# EAGLE board cas48 (EAGLE 5.10), part 1 of 2
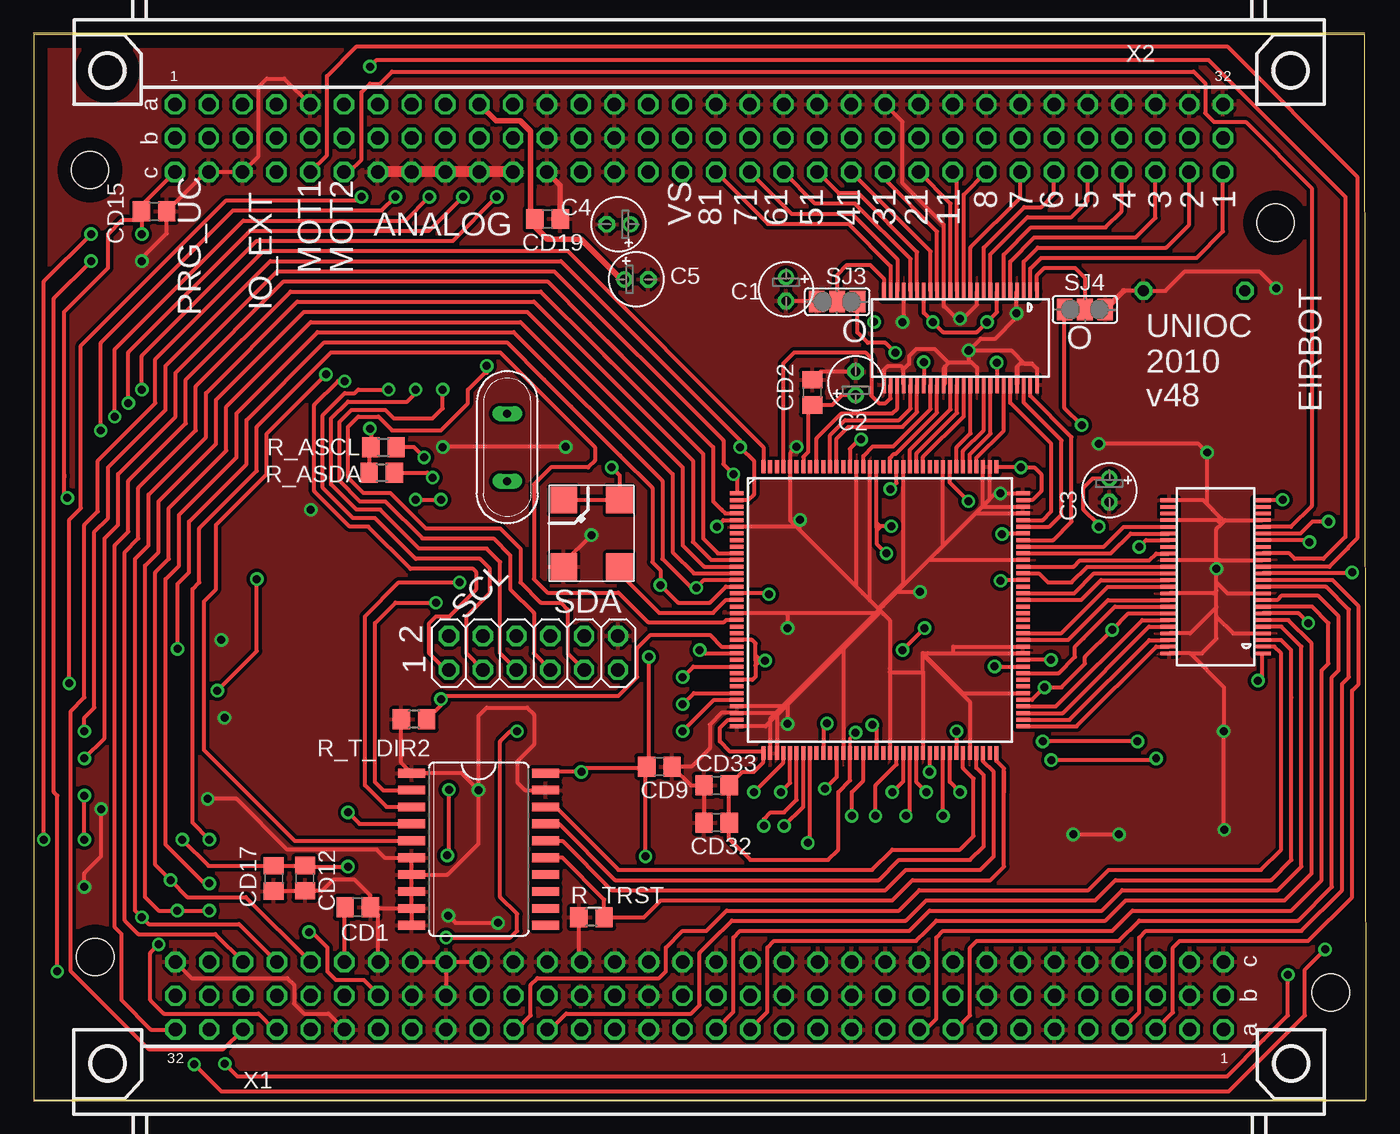
[diagram p2: board, top side]
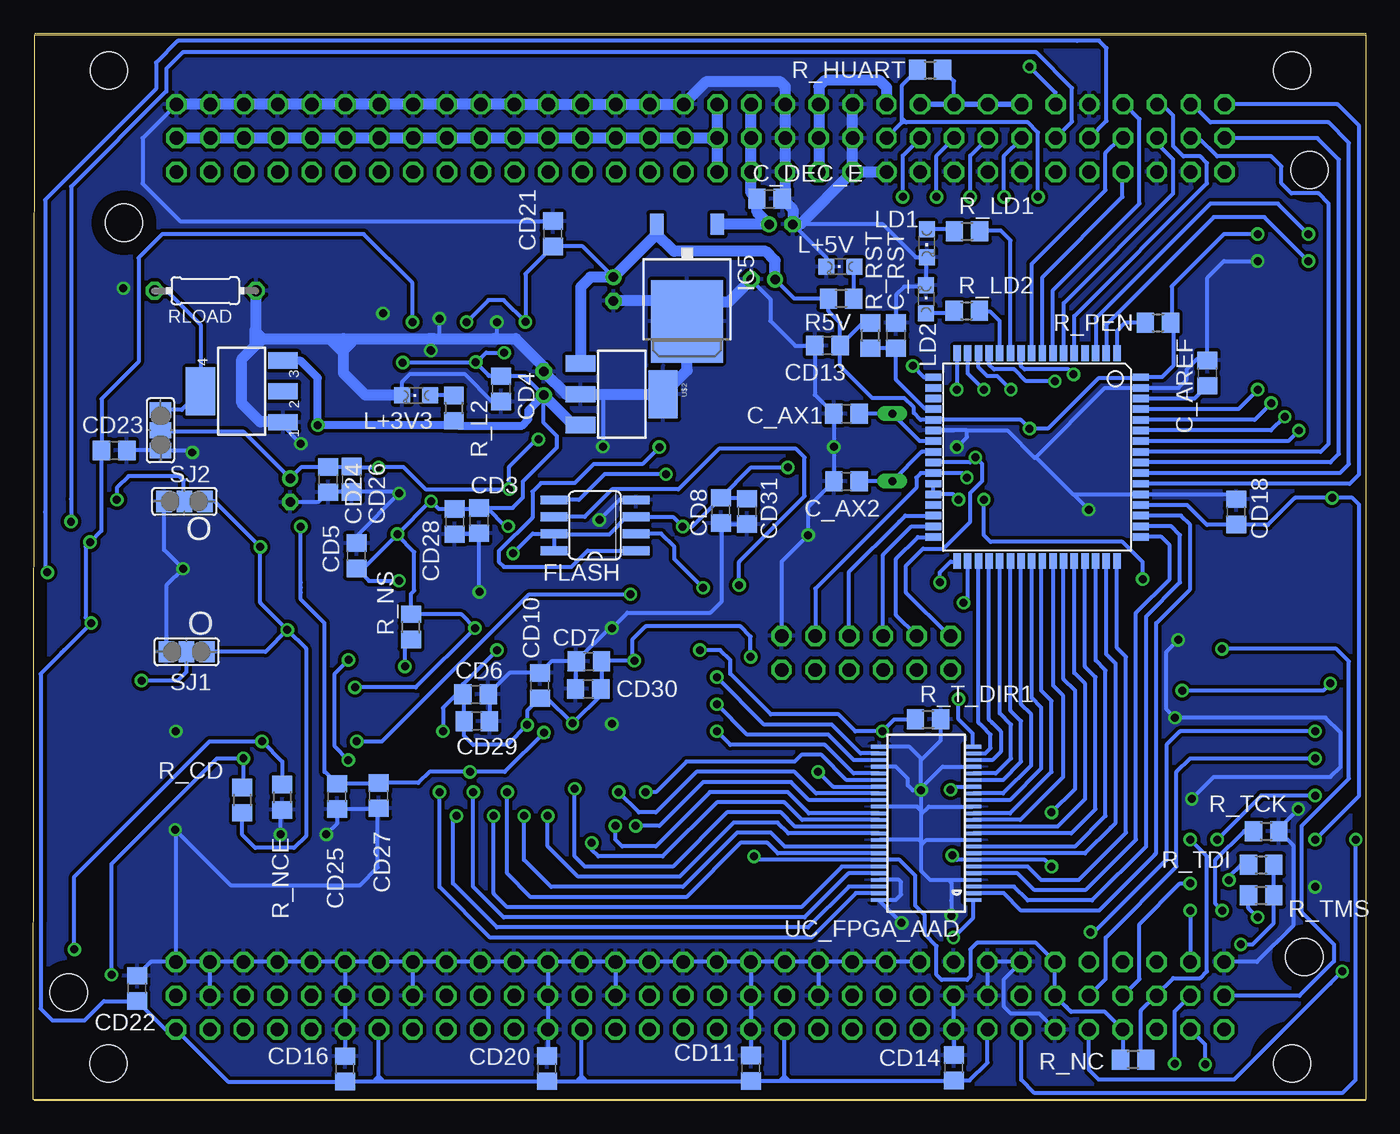
[diagram p3: board, bottom side, seen from below]

Size 100.11 x 80 mm. Coordinates in mm from the lower left corner, seen from the top.
Outline: 0,0 100.11,0 100,80 0,80 0,0
Copper layers (1*16): Top 0.035mm / dielectric 1.5mm / Bottom 0.035mm
Design rules "default *": minimum track width 10mil, minimum drill 24mil, track to track 10mil, track to pad 10mil, pad to pad 10mil, via to via 10mil, smd to smd 10mil, copper to edge 40mil, drill to drill 8mil, minimum pad ring 10mil, minimum via ring 8mil, stop-mask expansion 4mil, vias tented up to drill 0mil, thermal gap 10mil
Holes 2.8 mm at 4.24,69.84 93.3,65.88 97.45,8.06 4.63,10.74

## Footprints (pad centres in the part's own frame; a part is rotated, then mirrored left to right if it is on the bottom)
E1,8-4 = drill 0.711 pad 1.168 round: + -0.889,0 | drill 0.711 pad 1.168 octagon: - 0.889,0
C0805 = smd 1.3 x 1.5: 1 -0.95,0; 2 0.95,0
SO08 = smd 0.66 x 2.032: 1 -1.905,-3.073; 2 -0.635,-3.073; 3 0.635,-3.073; 4 1.905,-3.073; 5 1.905,3.073; 6 0.635,3.073; 7 -0.635,3.073; 8 -1.905,3.073
TQFP144 = smd 1 x 0.3: 1 -10.75,8.75; 2 -10.75,8.25; 3 -10.75,7.75; 4 -10.75,7.25; 5 -10.75,6.75; 6 -10.75,6.25; 7 -10.75,5.75; 8 -10.75,5.25; 9 -10.75,4.75; 10 -10.75,4.25; 11 -10.75,3.75; 12 -10.75,3.25; 13 -10.75,2.75; 14 -10.75,2.25; 15 -10.75,1.75; 16 -10.75,1.25; 17 -10.75,0.75; 18 -10.75,0.25; 19 -10.75,-0.25; 20 -10.75,-0.75; 21 -10.75,-1.25; 22 -10.75,-1.75; 23 -10.75,-2.25; 24 -10.75,-2.75; 25 -10.75,-3.25; 26 -10.75,-3.75; 27 -10.75,-4.25; 28 -10.75,-4.75; 29 -10.75,-5.25; 30 -10.75,-5.75; 31 -10.75,-6.25; 32 -10.75,-6.75; 33 -10.75,-7.25; 34 -10.75,-7.75; 35 -10.75,-8.25; 36 -10.75,-8.75; 73 10.75,-8.75; 74 10.75,-8.25; 75 10.75,-7.75; 76 10.75,-7.25; 77 10.75,-6.75; 78 10.75,-6.25; 79 10.75,-5.75; 80 10.75,-5.25; 81 10.75,-4.75; 82 10.75,-4.25; 83 10.75,-3.75; 84 10.75,-3.25; 85 10.75,-2.75; 86 10.75,-2.25; 87 10.75,-1.75; 88 10.75,-1.25; 89 10.75,-0.75; 90 10.75,-0.25; 91 10.75,0.25; 92 10.75,0.75; 93 10.75,1.25; 94 10.75,1.75; 95 10.75,2.25; 96 10.75,2.75; 97 10.75,3.25; 98 10.75,3.75; 99 10.75,4.25; 100 10.75,4.75; 101 10.75,5.25; 102 10.75,5.75; 103 10.75,6.25; 104 10.75,6.75; 105 10.75,7.25; 106 10.75,7.75; 107 10.75,8.25; 108 10.75,8.75 | smd 0.3 x 1: 37 -8.75,-10.75; 38 -8.25,-10.75; 39 -7.75,-10.75; 40 -7.25,-10.75; 41 -6.75,-10.75; 42 -6.25,-10.75; 43 -5.75,-10.75; 44 -5.25,-10.75; 45 -4.75,-10.75; 46 -4.25,-10.75; 47 -3.75,-10.75; 48 -3.25,-10.75; 49 -2.75,-10.75; 50 -2.25,-10.75; 51 -1.75,-10.75; 52 -1.25,-10.75; 53 -0.75,-10.75; 54 -0.25,-10.75; 55 0.25,-10.75; 56 0.75,-10.75; 57 1.25,-10.75; 58 1.75,-10.75; 59 2.25,-10.75; 60 2.75,-10.75; 61 3.25,-10.75; 62 3.75,-10.75; 63 4.25,-10.75; 64 4.75,-10.75; 65 5.25,-10.75; 66 5.75,-10.75; 67 6.25,-10.75; 68 6.75,-10.75; 69 7.25,-10.75; 70 7.75,-10.75; 71 8.25,-10.75; 72 8.75,-10.75; 109 8.75,10.75; 110 8.25,10.75; 111 7.75,10.75; 112 7.25,10.75; 113 6.75,10.75; 114 6.25,10.75; 115 5.75,10.75; 116 5.25,10.75; 117 4.75,10.75; 118 4.25,10.75; 119 3.75,10.75; 120 3.25,10.75; 121 2.75,10.75; 122 2.25,10.75; 123 1.75,10.75; 124 1.25,10.75; 125 0.75,10.75; 126 0.25,10.75; 127 -0.25,10.75; 128 -0.75,10.75; 129 -1.25,10.75; 130 -1.75,10.75; 131 -2.25,10.75; 132 -2.75,10.75; 133 -3.25,10.75; 134 -3.75,10.75; 135 -4.25,10.75; 136 -4.75,10.75; 137 -5.25,10.75; 138 -5.75,10.75; 139 -6.25,10.75; 140 -6.75,10.75; 141 -7.25,10.75; 142 -7.75,10.75; 143 -8.25,10.75; 144 -8.75,10.75
SJ_2 = smd 1.168 x 1.6: 1 -1.524,0; 2 0,0; 3 1.524,0
SOT223 = smd 1.219 x 2.235: 1 -2.311,-3.099; 2 0,-3.099; 3 2.311,-3.099 | smd 3.6 x 2.2: 4 0,3.099
TO252 = smd 1 x 1.6: 1 -2.28,-4.8; 2 2.28,-4.8 | smd 5.4 x 6.2: 3 0,2.5
2X06 = drill 1.016 octagon: 1 -6.35,-1.27; 2 -6.35,1.27; 3 -3.81,-1.27; 4 -3.81,1.27; 5 -1.27,-1.27; 6 -1.27,1.27; 7 1.27,-1.27; 8 1.27,1.27; 9 3.81,-1.27; 10 3.81,1.27; 11 6.35,-1.27; 12 6.35,1.27
CHIPLED_0805 = smd 1.2 x 1.2: A 0,-1.05; C 0,1.05
SMD_Q_NG = smd 2 x 2: 1 -1,1; 2 4,1; 3 4,5.2; 4 -1,5.2
QS = drill 0.61 long: 1 -2.54,0; 2 2.54,0
R0805 = smd 1.3 x 1.5: 1 -0.95,0; 2 0.95,0
0204/7 = drill 0.813 octagon: 1 -3.81,0; 2 3.81,0
N_SOP48 = smd 0.27 x 1.3: 1 -1.5,-2; 2 -1,-2; 3 -0.5,-2; 4 0,-2; 5 0.5,-2; 6 1,-2; 7 1.5,-2; 8 2,-2; 9 2.5,-2; 10 3,-2; 11 3.5,-2; 12 4,-2; 13 4.5,-2; 14 5,-2; 15 5.5,-2; 16 6,-2; 17 6.5,-2; 18 7,-2; 19 7.5,-2; 20 8,-2; 21 8.5,-2; 22 9,-2; 23 9.5,-2; 24 10,-2; 25 10,5; 26 9.5,5; 27 9,5; 28 8.5,5; 29 8,5; 30 7.5,5; 31 7,5; 32 6.5,5; 33 6,5; 34 5.5,5; 35 5,5; 36 4.5,5; 37 4,5; 38 3.5,5; 39 3,5; 40 2.5,5; 41 2,5; 42 1.5,5; 43 1,5; 44 0.5,5; 45 0,5; 46 -0.5,5; 47 -1,5; 48 -1.5,5
TQFP64 = smd 1.194 x 0.559: 1 -7.8,6; 2 -7.8,5.2; 3 -7.8,4.4; 4 -7.8,3.6; 5 -7.8,2.8; 6 -7.8,2; 7 -7.8,1.2; 8 -7.8,0.4; 9 -7.8,-0.4; 10 -7.8,-1.2; 11 -7.8,-2; 12 -7.8,-2.8; 13 -7.8,-3.6; 14 -7.8,-4.4; 15 -7.8,-5.2; 16 -7.8,-6; 33 7.8,-6; 34 7.8,-5.2; 35 7.8,-4.4; 36 7.8,-3.6; 37 7.8,-2.8; 38 7.8,-2; 39 7.8,-1.2; 40 7.8,-0.4; 41 7.8,0.4; 42 7.8,1.2; 43 7.8,2; 44 7.8,2.8; 45 7.8,3.6; 46 7.8,4.4; 47 7.8,5.2; 48 7.8,6 | smd 0.559 x 1.194: 17 -6,-7.8; 18 -5.2,-7.8; 19 -4.4,-7.8; 20 -3.6,-7.8; 21 -2.8,-7.8; 22 -2,-7.8; 23 -1.2,-7.8; 24 -0.4,-7.8; 25 0.4,-7.8; 26 1.2,-7.8; 27 2,-7.8; 28 2.8,-7.8; 29 3.6,-7.8; 30 4.4,-7.8; 31 5.2,-7.8; 32 6,-7.8; 49 6,7.8; 50 5.2,7.8; 51 4.4,7.8; 52 3.6,7.8; 53 2.8,7.8; 54 2,7.8; 55 1.2,7.8; 56 0.4,7.8; 57 -0.4,7.8; 58 -1.2,7.8; 59 -2,7.8; 60 -2.8,7.8; 61 -3.6,7.8; 62 -4.4,7.8; 63 -5.2,7.8; 64 -6,7.8
SO20W = smd 0.66 x 2.032: 1 -5.715,-5.029; 2 -4.445,-5.029; 3 -3.175,-5.029; 4 -1.905,-5.029; 5 -0.635,-5.029; 6 0.635,-5.029; 7 1.905,-5.029; 8 3.175,-5.029; 9 4.445,-5.029; 10 5.715,-5.029; 11 5.715,5.029; 12 4.445,5.029; 13 3.175,5.029; 14 1.905,5.029; 15 0.635,5.029; 16 -0.635,5.029; 17 -1.905,5.029; 18 -3.175,5.029; 19 -4.445,5.029; 20 -5.715,5.029
FABC96R = drill 1.016 octagon: A1 -2.54,39.37; A2 -2.54,36.83; A3 -2.54,34.29; A4 -2.54,31.75; A5 -2.54,29.21; A6 -2.54,26.67; A7 -2.54,24.13; A8 -2.54,21.59; A9 -2.54,19.05; A10 -2.54,16.51; A11 -2.54,13.97; A12 -2.54,11.43; A13 -2.54,8.89; A14 -2.54,6.35; A15 -2.54,3.81; A16 -2.54,1.27; A17 -2.54,-1.27; A18 -2.54,-3.81; A19 -2.54,-6.35; A20 -2.54,-8.89; A21 -2.54,-11.43; A22 -2.54,-13.97; A23 -2.54,-16.51; A24 -2.54,-19.05; A25 -2.54,-21.59; A26 -2.54,-24.13; A27 -2.54,-26.67; A28 -2.54,-29.21; A29 -2.54,-31.75; A30 -2.54,-34.29; A31 -2.54,-36.83; A32 -2.54,-39.37; B1 -5.08,39.37; B2 -5.08,36.83; B3 -5.08,34.29; B4 -5.08,31.75; B5 -5.08,29.21; B6 -5.08,26.67; B7 -5.08,24.13; B8 -5.08,21.59; B9 -5.08,19.05; B10 -5.08,16.51; B11 -5.08,13.97; B12 -5.08,11.43; B13 -5.08,8.89; B14 -5.08,6.35; B15 -5.08,3.81; B16 -5.08,1.27; B17 -5.08,-1.27; B18 -5.08,-3.81; B19 -5.08,-6.35; B20 -5.08,-8.89; B21 -5.08,-11.43; B22 -5.08,-13.97; B23 -5.08,-16.51; B24 -5.08,-19.05; B25 -5.08,-21.59; B26 -5.08,-24.13; B27 -5.08,-26.67; B28 -5.08,-29.21; B29 -5.08,-31.75; B30 -5.08,-34.29; B31 -5.08,-36.83; B32 -5.08,-39.37; C1 -7.62,39.37; C2 -7.62,36.83; C3 -7.62,34.29; C4 -7.62,31.75; C5 -7.62,29.21; C6 -7.62,26.67; C7 -7.62,24.13; C8 -7.62,21.59; C9 -7.62,19.05; C10 -7.62,16.51; C11 -7.62,13.97; C12 -7.62,11.43; C13 -7.62,8.89; C14 -7.62,6.35; C15 -7.62,3.81; C16 -7.62,1.27; C17 -7.62,-1.27; C18 -7.62,-3.81; C19 -7.62,-6.35; C20 -7.62,-8.89; C21 -7.62,-11.43; C22 -7.62,-13.97; C23 -7.62,-16.51; C24 -7.62,-19.05; C25 -7.62,-21.59; C26 -7.62,-24.13; C27 -7.62,-26.67; C28 -7.62,-29.21; C29 -7.62,-31.75; C30 -7.62,-34.29; C31 -7.62,-36.83; C32 -7.62,-39.37 | hole 2.794: 0,-44.456; 0,44.456

## Placement (x,y rotation side)
C1  470n  [E1,8-4]  56.53,60.89 270 top
C2  33u  [E1,8-4]  61.76,53.81 90 top
C3  100n  [E1,8-4]  80.81,45.79 270 top
C4  1u  [E1,8-4]  43.95,65.76 180 top
C5  100n  [E1,8-4]  45.28,61.62 0 top
C_AREF  100n  [C0805]  11.91,54.59 90 bottom
C_AX1  22p  [C0805]  39.02,51.53 180 bottom
C_AX2  22p  [C0805]  39.01,46.45 180 bottom
C_DEC_E  300n  [C0805]  44.79,67.67 0 bottom
C_RST  100n  [C0805]  35.31,57.4 90 bottom
CD1  100n  [C0805]  24.35,14.47 0 top
CD2  100n  [C0805]  58.51,53.13 90 top
CD3  100n  [C0805]  66.62,43.51 270 bottom
CD4  100n  [C0805]  64.97,53.4 270 bottom
CD5  100n  [C0805]  75.83,40.87 90 bottom
CD6  100n  [C0805]  66.88,30.46 0 bottom
CD7  100n  [C0805]  58.38,32.93 180 bottom
CD8  100n  [C0805]  48.47,44.27 270 bottom
CD9  100n  [C0805]  47,25.04 0 top
CD10  100n  [C0805]  62.06,31.12 90 bottom
CD11  100n  [C0805]  46.21,2.38 90 bottom
CD12  100n  [C0805]  20.39,16.65 270 top
CD13  100n  [C0805]  40.45,56.66 180 bottom
CD14  100n  [C0805]  30.97,2.42 90 bottom
CD15  100n  [C0805]  9.05,66.73 0 top
CD16  100n  [C0805]  76.69,2.33 90 bottom
CD17  100n  [C0805]  18.04,16.63 270 top
CD18  100n  [C0805]  9.75,44.16 90 bottom
CD19  100n  [C0805]  38.61,66.16 0 top
CD20  100n  [C0805]  61.53,2.35 90 bottom
CD21  100n  [C0805]  61.07,65.05 90 bottom
CD22  100n  [C0805]  92.31,8.38 90 bottom
CD23  100n  [C0805]  94.03,48.77 0 bottom
CD24  100n  [C0805]  77.96,46.59 270 bottom
CD25  100n  [C0805]  77.29,22.79 270 bottom
CD26  10n  [C0805]  76.2,46.61 270 bottom
CD27  10n  [C0805]  74.17,22.86 270 bottom
CD28  10n  [C0805]  68.45,43.43 270 bottom
CD29  10n  [C0805]  66.8,28.45 0 bottom
CD30  10n  [C0805]  58.42,30.86 180 bottom
CD31  10n  [C0805]  46.48,44.2 270 bottom
CD32  100n  [C0805]  51.31,20.83 180 top
CD33  10n  [C0805]  51.31,23.62 180 top
FLASH  EPCS1SI8  [SO08]  57.92,43.16 90 bottom
FPGA  EP2C5T144  [TQFP144]  63.58,36.8 0 top
H1V2  [SJ_2]  90.55,50.29 90 bottom
IC1  317EMP  [SOT223]  84.45,53.21 90 bottom
IC5  7805DT  [TO252]  51,60.97 180 bottom
INTERNE  [2X06]  37.55,33.57 0 top
L+3V3  [CHIPLED_0805]  71.34,52.91 90 bottom
L+5V  [CHIPLED_0805]  39.48,62.58 90 bottom
LD1  [CHIPLED_0805]  32.99,64.32 180 bottom
LD2  [CHIPLED_0805]  33.04,60.13 0 bottom
OSC_FPGA  XO91050UITA-50MHZLEVRAI  [SMD_Q_NG]  38.82,44.04 270 top
Q1  16MHz  [QS]  35.58,49.01 270 top
R5V  220  [R0805]  39.43,60.17 180 bottom
R_ASCL  4.7k  [R0805]  26.29,49.02 0 top
R_ASDA  4.7k  [R0805]  26.16,47.12 0 top
R_CD  10k  [R0805]  84.42,22.51 270 bottom
R_HUART  4.7k  [R0805]  32.74,77.35 0 bottom
R_L2  100  [R0805]  68.52,51.96 270 bottom
R_LD1  220  [R0805]  29.96,65.24 0 bottom
R_LD2  220  [R0805]  29.99,59.27 0 bottom
R_NC  10k  [R0805]  17.49,3.01 180 bottom
R_NCE  10k  [R0805]  81.41,22.73 270 bottom
R_NS  10k  [R0805]  71.74,35.52 90 bottom
R_PEN  4.7k  [R0805]  15.62,58.37 0 bottom
R_RST  10k  [R0805]  37.21,57.4 90 bottom
R_T_DIR1  4.7k  [R0805]  32.89,28.57 0 bottom
R_T_DIR2  4.7k  [R0805]  28.57,28.57 180 top
R_TCK  1k  [R0805]  7.49,20.19 0 bottom
R_TDI  10k  [R0805]  7.87,17.65 0 bottom
R_TMS  10k  [R0805]  7.87,15.37 0 bottom
R_TRST  4.7k  [R0805]  41.91,13.72 180 top
RLOAD  100  [0204/7]  87.19,60.77 180 bottom
SJ1  [SJ_2]  88.6,33.66 0 bottom
SJ2  [SJ_2]  88.76,44.95 0 bottom
SJ3  [SJ_2]  60.37,59.95 0 top
SJ4  [SJ_2]  78.98,59.36 180 top
TGPIO  SN74ALVC164245DGGRPACKAGE_MIEU  [N_SOP48]  73.88,58.72 180 top
TSPECIAL  SN74ALVC164245DGGRPACKAGE_MIEU  [N_SOP48]  90.3,35.04 90 top
U$2  LM3940SOT-223  [SOT223]  55.9,52.99 270 bottom
UC  MEGA128-A  [TQFP64]  24.71,48.27 270 bottom
UC_FPGA  74HC541DW  [SO20W]  33.44,18.83 270 top
UC_FPGA_AAD  SN74ALVC164245DGGRPACKAGE_MIEU  [N_SOP48]  31.54,16.52 90 bottom
X1  FABC96R  [FABC96R]  50.02,2.74 270 top
X2  FABC96R  [FABC96R]  49.99,77.31 90 top